# Altium project USB_power_meter_v1.PrjPcb
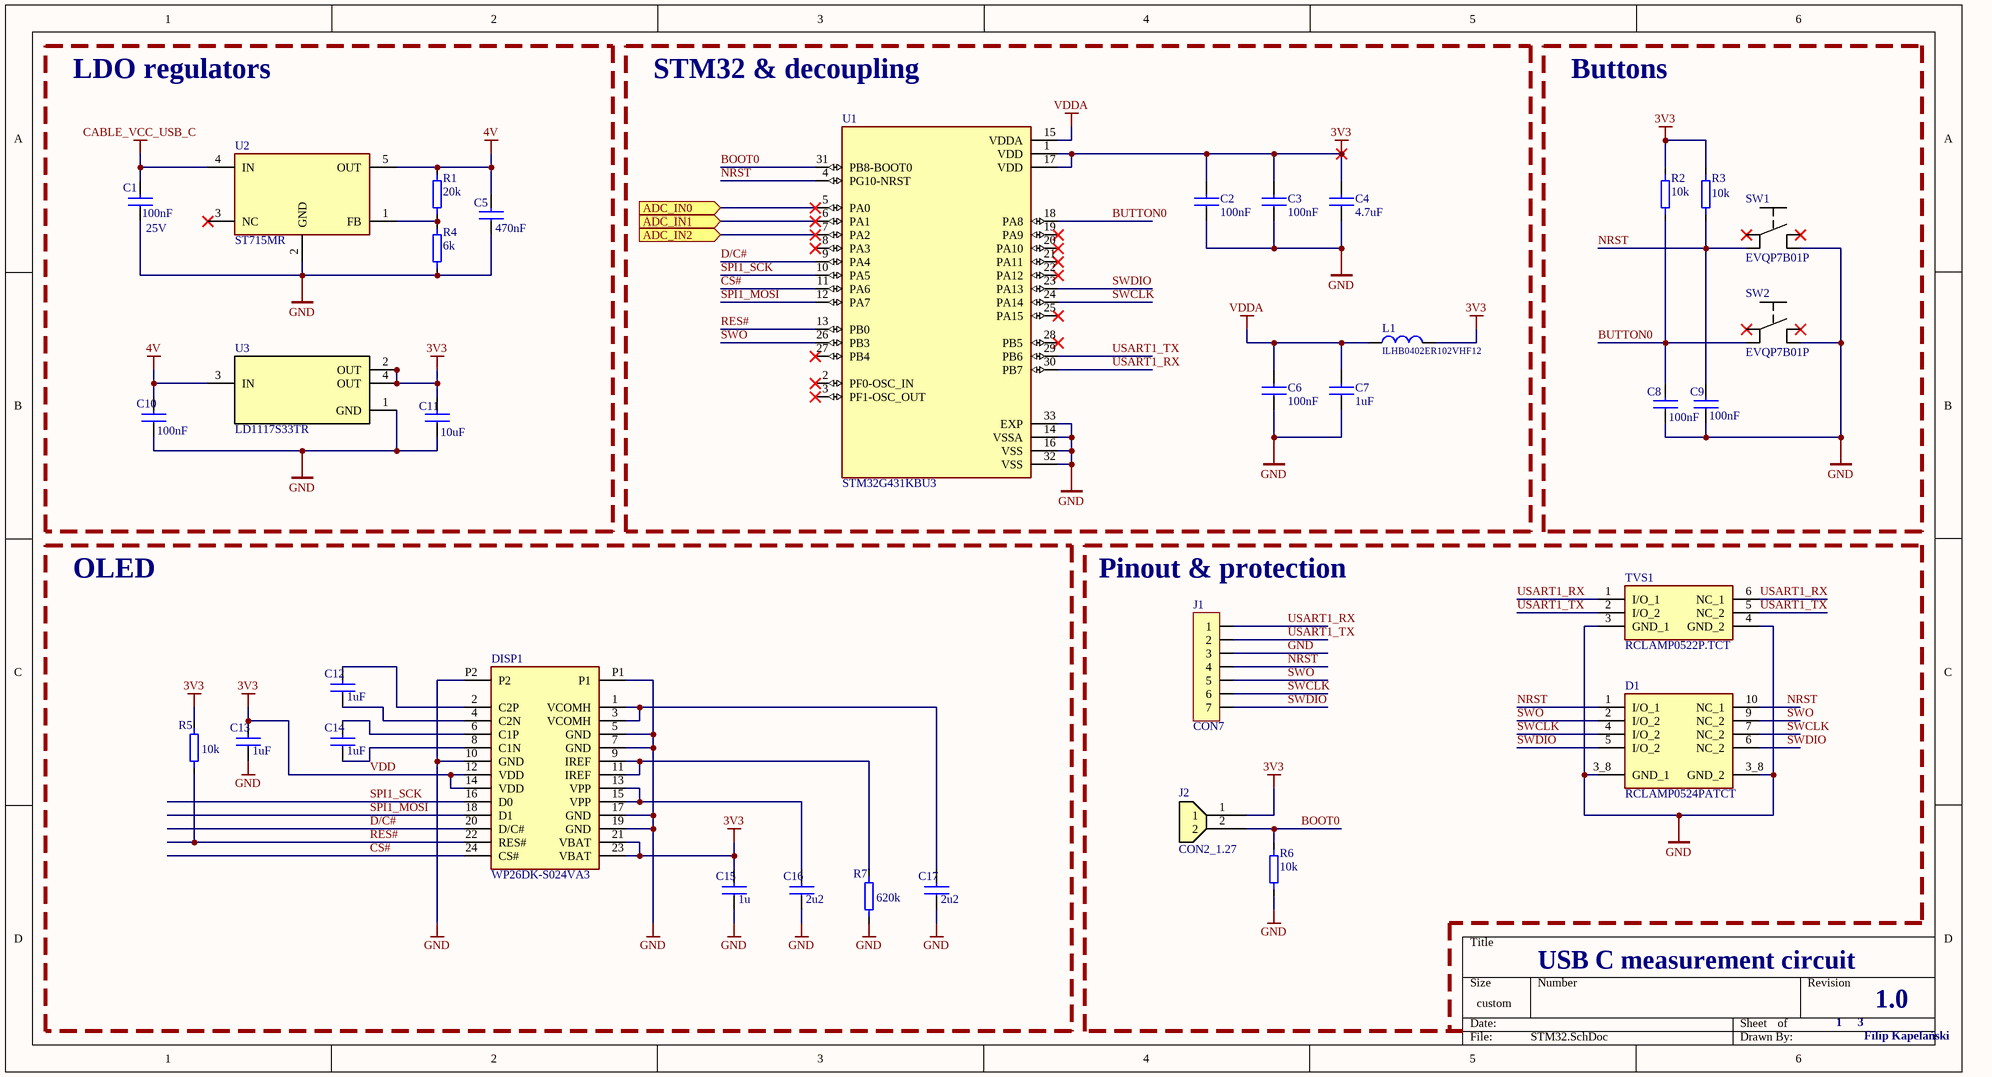
[diagram p0: STM32.SchDoc]
2 sheets, 64 parts. Net scope: flat (ports and power ports of the same name join across sheets).
Sheets:
  STM32.SchDoc
  MeasurementCircuit.SchDoc

## Sheet STM32.SchDoc
size 368 x 200 mm; SheetNumber: 1; SheetTotal: 2

### Parts
C1  100nF  Voltage: 25V  [C0402]
C2  100nF  [C0402]
C3  100nF  [C0402]
C4  4.7uF  [C0402]
C5  470nF  [C0402]
C6  100nF  [C0402]
C7  1uF  [C0402]
C8  100nF  [C0402]
C9  100nF  [C0402]
C10  100nF  [C0402]
C11  10uF  [C0402]
C12  1uF  [C0402]
C13  1uF  [C0402]
C14  1uF  [C0402]
C15  1u  [C0603]
C16  2u2  [C0402]
C17  2u2  [C0402]
D1  RCLAMP0524PATCT  [DIO_RCLAMP0524PATCT]
DISP1  WP26DK-S024VA3  [WP26DK-S024VA3]
J1  CON7  [SIP7]
J2  CON2_1.27  [CON2_1.27]
L1  ILHB0402ER102VHF12  [L0402]
R1  20k  [R0805]
R2  10k  [R0402]
R3  10k  [R0402]
R4  6k  [R0805]
R5  10k  [R0402]
R6  10k  [R0402]
R7  620k  [R0402]
SW1  EVQP7B01P  [EVQP7B01P]
SW2  EVQP7B01P  [EVQP7B01P]
TVS1  RCLAMP0522P.TCT  [RCLAMP0522PTCT]
U1  STM32G431KBU3  [STM32G431KBU3]
U2  ST715MR  [ST715MR]
U3  LD1117S33TR  [LD1117S33TR]

### Blocks framed on the sheet
LDO regulators: C1 C5 C10 C11 R1 R4 U2 U3
STM32 & decoupling: C2-C4 C6 C7 L1 U1
Buttons: C8 C9 R2 R3 SW1 SW2
OLED: C12-C17 DISP1 R5 R7

### Ports
ADC_IN0 (in, see MeasurementCircuit[3A]), ADC_IN1 (in, see MeasurementCircuit[1D]), ADC_IN2 (in, see MeasurementCircuit[2D])

### Nets
4V: C5.2 C10.2 R1.1 U2.5(OUT) U3.3(IN)
CABLE_VCC_USB_C: C1.2 U2.4(IN)
GND: C1.1 C2.1 C3.1 C4.1 C5.1 C6.1 C7.1 C8.1 C9.1 C10.1 C11.1 C13.1 C15.1 C16.1 C17.1 D1.3_8(GND_1) DISP1.5(GND) DISP1.7(GND) DISP1.10(GND) DISP1.17(GND) DISP1.19(GND) DISP1.P1 DISP1.P2 J1.3 R4.2 R6.1 R7.2 SW1.2(S) SW2.2(S) TVS1.3(GND_1) TVS1.4(GND_2) U1.14(VSSA) U1.16(VSS) U1.32(VSS) U1.33(EXP) U2.2(GND) U3.1(GND)
VDD: C2.2 C3.2 C4.2 C11.2 C13.2 C15.2 DISP1.12(VDD) DISP1.14(VDD) DISP1.21(VBAT) DISP1.23(VBAT) J2.1 L1.1 R2.1 R3.1 R5.1 U1.1(VDD) U1.17(VDD) U3.2(OUT) U3.4(OUT)  [also labelled 3V3]
VDDA: C6.2 C7.2 L1.2 U1.15(VDDA)
BOOT0: J2.2 R6.2 U1.31(PB8-BOOT0)
BUTTON0: C8.2 R2.2 SW2.1(P) U1.18(PA8)
CS#: DISP1.24(CS#) U1.11(PA6)
D/C#: DISP1.20(D/C#) U1.9(PA4)
NRST: C9.2 D1.1(I/O_1) D1.10(NC_1) J1.4 R3.2 SW1.1(P) U1.4(PG10-NRST)
RES#: DISP1.22(RES#) R5.2 U1.13(PB0)
SPI1_MOSI: DISP1.18(D1) U1.12(PA7)
SPI1_SCK: DISP1.16(D0) U1.10(PA5)
SWCLK: D1.4(I/O_2) D1.7(NC_2) J1.6 U1.24(PA14)
SWDIO: D1.5(I/O_2) D1.6(NC_2) J1.7 U1.23(PA13)
SWO: D1.2(I/O_2) D1.9(NC_2) J1.5 U1.26(PB3)
USART1_RX: J1.1 TVS1.1(I/O_1) TVS1.6(NC_1) U1.30(PB7)
USART1_TX: J1.2 TVS1.2(I/O_2) TVS1.5(NC_2) U1.29(PB6)
NetC12_1: C12.1 DISP1.4(C2N)
NetC12_2: C12.2 DISP1.2(C2P)
NetC14_1: C14.1 DISP1.8(C1N)
NetC14_2: C14.2 DISP1.6(C1P)
NetC16_2: C16.2 DISP1.13(VPP) DISP1.15(VPP)
NetC17_2: C17.2 DISP1.1(VCOMH) DISP1.3(VCOMH)
NetC18_1: U1.5(PA0) ; port ADC_IN0
NetDISP1_9: DISP1.9(IREF) DISP1.11(IREF) R7.1
NetR1_2: R1.2 R4.1 U2.1(FB)
NetR17_2: U1.7(PA2) ; port ADC_IN2
NetR19_1: U1.6(PA1) ; port ADC_IN1

Not connected (* = marked no-connect by the designer): SW1 1'(P1)* 2'(S1)*; SW2 1'(P1)* 2'(S1)*; U1 2(PF0-OSC_IN)* 3(PF1-OSC_OUT)* 8(PA3)* 19(PA9)* 20(PA10)* 21(PA11)* 22(PA12)* 25(PA15)* 27(PB4)* 28(PB5)*; U2 3(NC)*

### Notes on the sheet
- (near J1) Pinout & protection
- USB C measurement circuit
- 1
- 3
- 1.0
- Filip Kapelański

### Library data of the parts
C1-C17 = C: Kondensator ceramiczny SMD; Supplier: *; SupplierURL: *; helpurl: *; Manufacturer: *; PartNumber: *; Price: *; Symbol: *; Package: *
  C1: Value: 100nF
  C2 C3 C6 C8-C10: Voltage: *; Value: 100nF
  C4: Voltage: *; Value: 4.7uF
  C5: Voltage: *; Value: 470nF
  C7 C12-C14: Voltage: *; Value: 1uF
  C11: Voltage: *; Value: 10uF
  C15: Voltage: *; Value: 1u
  C16 C17: Voltage: *; Value: 2u2
D1 = RCLAMP0524PATCT: 15V Clamp 5A (8/20Âµs) Ipp Tvs Diode Surface Mount SLP2510P8; MF: Semtech Corporation; SnapEDA_Link: https://www.snapeda.com/parts/RCLAMP0524PATCT/Semtech+Corporation/view-part/?ref=snap; Package: UFDFN-10 Semtech; Value: *; MP: RCLAMP0524PATCT; Check_prices: https://www.snapeda.com/parts/RCLAMP0524PATCT/Semtech+Corporation/view-part/?ref=eda
J1 = CON7: Connector
J2 = CON2_1.27: Złącze: kołkowe; listwa kołkowa; męskie; PIN: 2; THT; proste; 1,27mm
L1 = L: Cewka/Koralik ferrytowy; Supplier: *; SupplierURL: *; helpurl: *; Manufacturer: *; Package: *; PartNumber: *; Price: *; Symbol: *; Value: ILHB0402ER102VHF12
R1-R7 = R: Rezystor SMD; Supplier: *; SupplierURL: *; helpurl: *; Manufacturer: *; PartNumber: *; Price: *; Symbol: *; Package: *
  R1: Value: 20k
  R2 R3 R5 R6: Value: 10k
  R4: Value: 6k
  R7: Value: 620k
SW1 SW2 = EVQP7B01P: Switch Tactile N.O. SPST Rectangular Button J-Bend 0.05A 12VDC 2.2N SMD T/R
TVS1 = RCLAMP0522P.TCT: TVS Diode (Bi-directional); Manufacturer_Name: SEMTECH; Datasheet Link: https://www.digikey.ph/en/products/detail/semtech-corporation/RCLAMP0522P-TCT/5113632; Height: 0.65mm; Manufacturer_Part_Number: RCLAMP0522P.TCT; Mouser Part Number: 947-RCLAMP0522P.TCT; Mouser Price/Stock: https://www.mouser.co.uk/ProductDetail/Semtech/RCLAMP0522P.TCT?qs=rBWM4%252BvDhIdKBWbIaH8MsA%3D%3D; Arrow Part Number: RCLAMP0522P.TCT; Arrow Price/Stock: https://www.arrow.com/en/products/rclamp0522p.tct/semtech?utm_currency=USD&region=nac
U1 = STM32G431KBU3: ARM® Cortex®-M4F STM32G4 Microcontroller IC 32-Bit Single-Core 170MHz 128KB (128K x 8) FLASH 32-UFQFPN (5x5); ComponentLink1Description: New link; ComponentLink1URL: https://www.mouser.pl/ProductDetail/STMicroelectronics/STM32G431KBU3?qs=PzGy0jfpSMtowkKWTRQBRw%3D%3D
U2 = ST715MR: Linear Voltage Regulator IC Positive Adjustable 1 Output 85mA SOT-23-5
U3 = LD1117S33TR: Linear Voltage Regulator IC Positive Fixed 1 Output 800mA SOT-223

## Sheet MeasurementCircuit.SchDoc
size 322 x 215 mm; SheetNumber: 2; SheetTotal: 2
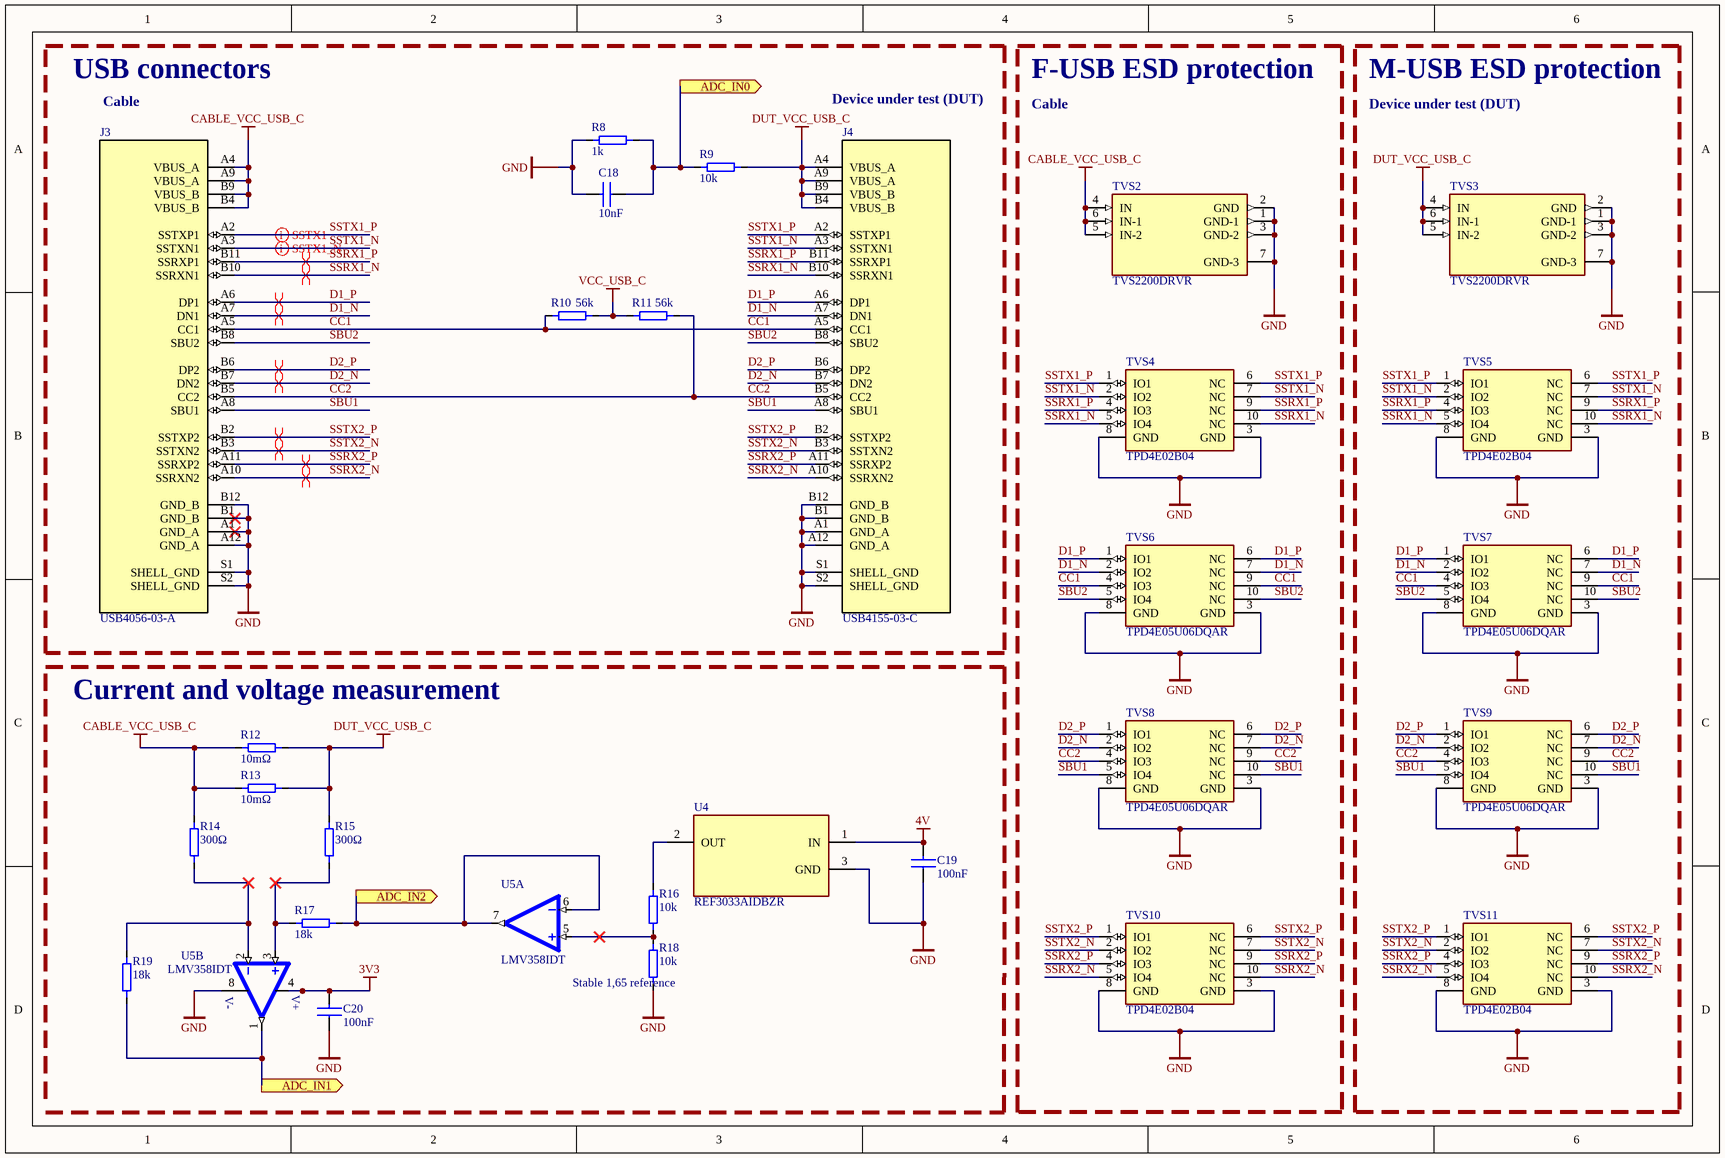
[diagram p1: MeasurementCircuit.SchDoc]

### Parts
C18  10nF  [C0402]
C19  100nF  [C0402]
C20  100nF  [C0402]
J3  USB4056-03-A  [usb4056-03-a]
J4  USB4155-03-C  [USB4155-03-C]
R8  1k  [R0805]
R9  10k  [R0805]
R10  56k  [R0402]
R11  56k  [R0402]
R12  10mΩ  [R1206]
R13  10mΩ  [R1206]
R14  300Ω  [R0402]
R15  300Ω  [R0402]
R16  10k  [R0402]
R17  18k  [R0402]
R18  10k  [R0402]
R19  18k  [R0402]
TVS2  TVS2200DRVR  [TVS2200DRVR]
TVS3  TVS2200DRVR  [TVS2200DRVR]
TVS4  TPD4E02B04  [TPD4E02B04]
TVS5  TPD4E02B04  [TPD4E02B04]
TVS6  TPD4E05U06DQAR  [TPD4E05U06DQAR]
TVS7  TPD4E05U06DQAR  [TPD4E05U06DQAR]
TVS8  TPD4E05U06DQAR  [TPD4E05U06DQAR]
TVS9  TPD4E05U06DQAR  [TPD4E05U06DQAR]
TVS10  TPD4E02B04  [TPD4E02B04]
TVS11  TPD4E02B04  [TPD4E02B04]
U4  REF3033AIDBZR  [REF3033AIDBZR]
U5  LMV358IDT  [LMV358IDT]  (parts A,B of 2)

### Blocks framed on the sheet
USB connectors: C18 J3 J4 R8-R11
F-USB ESD protection: TVS2 TVS4 TVS6 TVS8 TVS10
M-USB ESD protection: TVS3 TVS5 TVS7 TVS9 TVS11

### Ports
ADC_IN0 (out, see STM32[2A]), ADC_IN1 (out, see STM32[2A]), ADC_IN2 (out, see STM32[2A])

### Nets
3V3: C20.2 U5.4(VDD)  [project net VDD]
4V: C19.2 U4.1(IN)
CABLE_VCC_USB_C: J3.A4(VBUS_A) J3.A9(VBUS_A) J3.B4(VBUS_B) J3.B9(VBUS_B) R12.2 R13.2 R14.1 TVS2.4(IN) TVS2.5(IN-2) TVS2.6(IN-1)
DUT_VCC_USB_C: J4.A4(VBUS_A) J4.A9(VBUS_A) J4.B4(VBUS_B) J4.B9(VBUS_B) R9.2 R12.1 R13.1 R15.1 TVS3.4(IN) TVS3.5(IN-2) TVS3.6(IN-1)
GND: C18.2 C19.1 C20.1 J3.A1(GND_A) J3.A12(GND_A) J3.B1(GND_B) J3.B12(GND_B) J3.S1(SHELL_GND) J3.S2(SHELL_GND) J4.A1(GND_A) J4.A12(GND_A) J4.B1(GND_B) J4.B12(GND_B) J4.S1(SHELL_GND) J4.S2(SHELL_GND) R8.1 R18.1 TVS2.1(GND-1) TVS2.2(GND) TVS2.3(GND-2) TVS2.7(GND-3) TVS3.1(GND-1) TVS3.2(GND) TVS3.3(GND-2) TVS3.7(GND-3) TVS4.3(GND) TVS4.8(GND) TVS5.3(GND) TVS5.8(GND) TVS6.3(GND) TVS6.8(GND) TVS7.3(GND) TVS7.8(GND) TVS8.3(GND) TVS8.8(GND) TVS9.3(GND) TVS9.8(GND) TVS10.3(GND) TVS10.8(GND) TVS11.3(GND) TVS11.8(GND) U4.3(GND) U5.8(VCC)
VCC_USB_C: R10.2 R11.1
CC1: J3.A5(CC1) J4.A5(CC1) R10.1 TVS6.4(IO3) TVS6.9(NC) TVS7.4(IO3) TVS7.9(NC)
CC2: J3.B5(CC2) J4.B5(CC2) R11.2 TVS8.4(IO3) TVS8.9(NC) TVS9.4(IO3) TVS9.9(NC)
D1_N: J3.A7(DN1) J4.A7(DN1) TVS6.2(IO2) TVS6.7(NC) TVS7.2(IO2) TVS7.7(NC)
D1_P: J3.A6(DP1) J4.A6(DP1) TVS6.1(IO1) TVS6.6(NC) TVS7.1(IO1) TVS7.6(NC)
D2_N: J3.B7(DN2) J4.B7(DN2) TVS8.2(IO2) TVS8.7(NC) TVS9.2(IO2) TVS9.7(NC)
D2_P: J3.B6(DP2) J4.B6(DP2) TVS8.1(IO1) TVS8.6(NC) TVS9.1(IO1) TVS9.6(NC)
SBU1: J3.A8(SBU1) J4.A8(SBU1) TVS8.5(IO4) TVS8.10(NC) TVS9.5(IO4) TVS9.10(NC)
SBU2: J3.B8(SBU2) J4.B8(SBU2) TVS6.5(IO4) TVS6.10(NC) TVS7.5(IO4) TVS7.10(NC)
SSRX1_N: J3.B10(SSRXN1) J4.B10(SSRXN1) TVS4.5(IO4) TVS4.10(NC) TVS5.5(IO4) TVS5.10(NC)
SSRX1_P: J3.B11(SSRXP1) J4.B11(SSRXP1) TVS4.4(IO3) TVS4.9(NC) TVS5.4(IO3) TVS5.9(NC)
SSRX2_N: J3.A10(SSRXN2) J4.A10(SSRXN2) TVS10.5(IO4) TVS10.10(NC) TVS11.5(IO4) TVS11.10(NC)
SSRX2_P: J3.A11(SSRXP2) J4.A11(SSRXP2) TVS10.4(IO3) TVS10.9(NC) TVS11.4(IO3) TVS11.9(NC)
SSTX1_N: J3.A3(SSTXN1) J4.A3(SSTXN1) TVS4.2(IO2) TVS4.7(NC) TVS5.2(IO2) TVS5.7(NC)
SSTX1_P: J3.A2(SSTXP1) J4.A2(SSTXP1) TVS4.1(IO1) TVS4.6(NC) TVS5.1(IO1) TVS5.6(NC)
SSTX2_N: J3.B3(SSTXN2) J4.B3(SSTXN2) TVS10.2(IO2) TVS10.7(NC) TVS11.2(IO2) TVS11.7(NC)
SSTX2_P: J3.B2(SSTXP2) J4.B2(SSTXP2) TVS10.1(IO1) TVS10.6(NC) TVS11.1(IO1) TVS11.6(NC)
NetC18_1: C18.1 R8.2 R9.1 ; port ADC_IN0
NetR14_2: R14.2 R19.2 U5.2(INVERTING_INPUT1)
NetR15_2: R15.2 R17.1 U5.3(NON-INVERTING_INPUT1)
NetR16_1: R16.1 R18.2 U5.5(NON-INVERTING_INPUT2)
NetR16_2: R16.2 U4.2(OUT)
NetR17_2: R17.2 U5.6(INVERTING_INPUT2) U5.7(OUTPUT2) ; port ADC_IN2
NetR19_1: R19.1 U5.1(OUTPUT1) ; port ADC_IN1

### Layout directives
differential pair: D1_N, D1_P, D2_N, D2_P, SSRX1_N, SSRX1_P, SSRX2_N, SSRX2_P, SSTX1_N, SSTX1_P, SSTX2_N, SSTX2_P

### Notes on the sheet
- Cable
- Device under test (DUT)
- (near R12) Current and voltage measurement
- (near U5) Stable 1,65 reference
- (in symbol LMV358IDT, part B) V-; V+

### Library data of the parts
C18-C20 = C: Kondensator ceramiczny SMD; Supplier: *; SupplierURL: *; helpurl: *; Manufacturer: *; PartNumber: *; Price: *; Symbol: *; Package: *; Voltage: *
  C18: Value: 10nF
  C19 C20: Value: 100nF
J3 = USB4056-03-A: USB-C (USB TYPE-C) USB 3.2 Gen 2 (USB 3.1 Gen 2, Superspeed + (USB 3.1)) Receptacle Connector 24 Position Surface Mount, Right Angle; Through Hole
J4 = USB4155-03-C: USB-C (USB TYPE-C) USB 3.2 Gen 2 (USB 3.1 Gen 2, Superspeed + (USB 3.1)) Receptacle Connector 24 Position Surface Mount, Right Angle; Through Hole
R8-R19 = R: Rezystor SMD; Supplier: *; SupplierURL: *; helpurl: *; Manufacturer: *; PartNumber: *; Price: *; Symbol: *; Package: *
  R8: Value: 1k
  R9 R16 R18: Value: 10k
  R10 R11: Value: 56k
  R12 R13: Value: 10mΩ
  R14 R15: Value: 300Ω
  R17 R19: Value: 18k
TVS2 TVS3 = TVS2200DRVR: 22V flat-clamp surge protection device; ComponentLink1Description: New link; ComponentLink1URL: https://www.mouser.pl/ProductDetail/Texas-Instruments/TVS2200DRVR?qs=W0yvOO0ixfHPbvei2cYdIw%3D%3D
TVS6-TVS9 = TPD4E05U06DQAR: ESD Protection Diodes / TVS Diodes 0.66-pF +/-3.6-V +/- 30-kV ESD protectio; ComponentLink1Description: New link; ComponentLink1URL: https://www.mouser.pl/ProductDetail/Texas-Instruments/TPD4E05U06DQAR?qs=%2FCrDlo5IrVPi4woOvWz0qA%3D%3D
U4 = REF3033AIDBZR: 3.3-V voltage reference;   50-ppm/°C, 50-µA in 3-pin SOT-23 package series (bandgap)
U5 = LMV358IDT: Standard (General Purpose) Amplifier 2 Circuit Rail-to-Rail 8-SOIC
TVS4 TVS5 TVS10 TVS11 = TPD4E02B04: ComponentLink1Description: New link; ComponentLink1URL: https://www.mouser.pl/ProductDetail/Texas-Instruments/TPD4E02B04DQAR?qs=8%2FmU9qzJpL%2FFVYtHO1iV9g%3D%3D

## Nets that join several sheets
4V: STM32 (5 pins), MeasurementCircuit (C19.2 U4.1)
CABLE_VCC_USB_C: STM32 (C1.2 U2.4), MeasurementCircuit (10 pins)
GND: STM32 (37 pins), MeasurementCircuit (43 pins)
VDD: STM32 (19 pins), MeasurementCircuit (C20.2 U5.4)
NetC18_1: STM32 (U1.5), MeasurementCircuit (C18.1 R8.2 R9.1)
NetR17_2: STM32 (U1.7), MeasurementCircuit (R17.2 U5.6 U5.7)
NetR19_1: STM32 (U1.6), MeasurementCircuit (R19.1 U5.1)